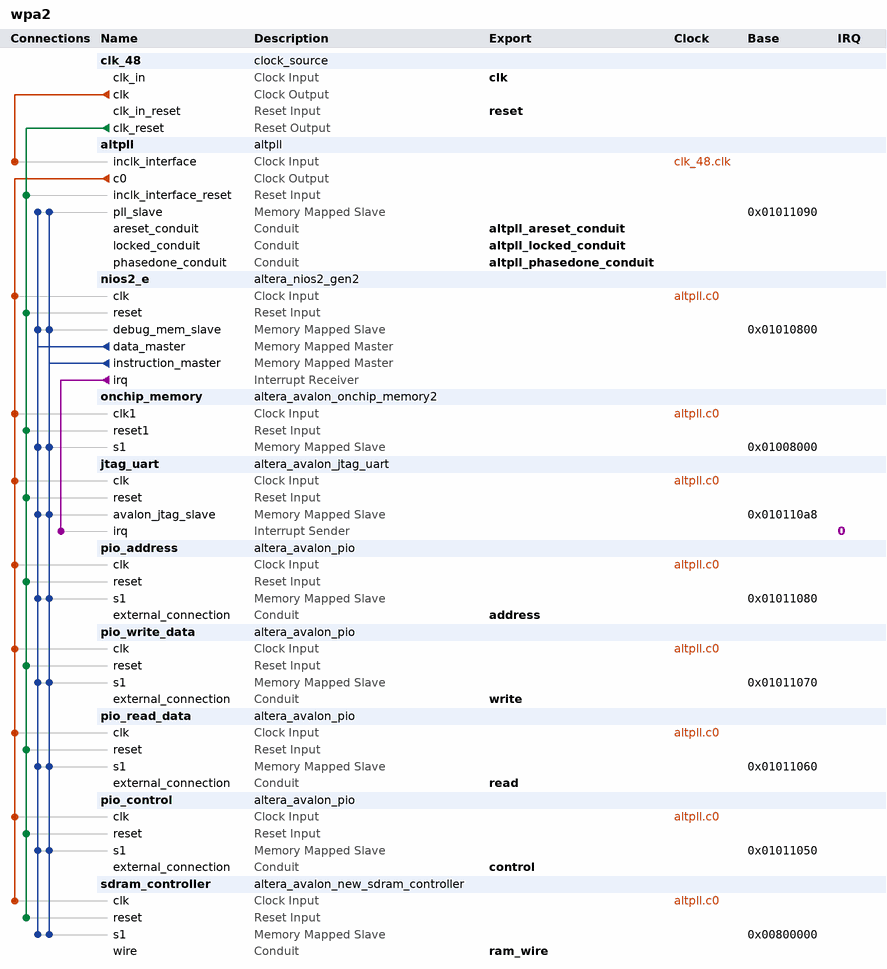
[diagram p0: system contents]
# Platform Designer (Qsys) system wpa2, Cyclone IV E EP4CE6E22C8
# Parameters at their usual value, and those the tool derives, are not listed.
package require -exact qsys 15.1
create_system wpa2
set_project_property DEVICE_FAMILY {Cyclone IV E}
set_project_property DEVICE EP4CE6E22C8

add_instance clk_48 clock_source 15.1
set_instance_parameter_value clk_48 clockFrequency 50000000

add_instance altpll altpll 15.1
set_instance_parameter_value altpll CLK0_DIVIDE_BY 12
set_instance_parameter_value altpll CLK0_MULTIPLY_BY 25
set_instance_parameter_value altpll INCLK0_INPUT_FREQUENCY 20833
set_instance_parameter_value altpll PORT_ARESET PORT_UNUSED
set_instance_parameter_value altpll PORT_LOCKED PORT_UNUSED
set_instance_parameter_value altpll PORT_clk1 PORT_UNUSED
set_instance_parameter_value altpll PORT_clk2 PORT_UNUSED
set_instance_parameter_value altpll PORT_clk3 PORT_UNUSED

add_instance nios2_e altera_nios2_gen2 15.1
set_instance_parameter_value nios2_e dcache_size 2048
set_instance_parameter_value nios2_e exceptionSlave onchip_memory.s1
set_instance_parameter_value nios2_e icache_size 4096
set_instance_parameter_value nios2_e impl Tiny
set_instance_parameter_value nios2_e resetSlave onchip_memory.s1

add_instance onchip_memory altera_avalon_onchip_memory2 15.1
set_instance_parameter_value onchip_memory dataWidth 32
set_instance_parameter_value onchip_memory dualPort false
set_instance_parameter_value onchip_memory initMemContent true
set_instance_parameter_value onchip_memory initializationFileName onchip_mem.hex
set_instance_parameter_value onchip_memory memorySize 25480

add_instance jtag_uart altera_avalon_jtag_uart 15.1
set_instance_parameter_value jtag_uart simInteractiveOptions NO_INTERACTIVE_WINDOWS

add_instance pio_address altera_avalon_pio 15.1
set_instance_parameter_value pio_address direction Output
set_instance_parameter_value pio_address width 8

add_instance pio_write_data altera_avalon_pio 15.1
set_instance_parameter_value pio_write_data direction Output
set_instance_parameter_value pio_write_data width 32

add_instance pio_read_data altera_avalon_pio 15.1
set_instance_parameter_value pio_read_data direction Input
set_instance_parameter_value pio_read_data simDoTestBenchWiring true
set_instance_parameter_value pio_read_data width 32

add_instance pio_control altera_avalon_pio 15.1
set_instance_parameter_value pio_control direction Bidir
set_instance_parameter_value pio_control simDoTestBenchWiring true
set_instance_parameter_value pio_control width 8

add_instance sdram_controller altera_avalon_new_sdram_controller 15.1
set_instance_parameter_value sdram_controller TAC 5.0
set_instance_parameter_value sdram_controller TRCD 20.0
set_instance_parameter_value sdram_controller TRP 20.0
set_instance_parameter_value sdram_controller casLatency 3
set_instance_parameter_value sdram_controller columnWidth 8
set_instance_parameter_value sdram_controller dataWidth 16
set_instance_parameter_value sdram_controller generateSimulationModel false
set_instance_parameter_value sdram_controller model single_Micron_MT48LC4M32B2_7_chip
set_instance_parameter_value sdram_controller numberOfBanks 4
set_instance_parameter_value sdram_controller numberOfChipSelects 1
set_instance_parameter_value sdram_controller powerUpDelay 100.0
set_instance_parameter_value sdram_controller refreshPeriod 15.625
set_instance_parameter_value sdram_controller rowWidth 12

# connections
add_connection altpll.c0 jtag_uart.clk clock
add_connection altpll.c0 nios2_e.clk clock
add_connection altpll.c0 onchip_memory.clk1 clock
add_connection altpll.c0 pio_address.clk clock
add_connection altpll.c0 pio_control.clk clock
add_connection altpll.c0 pio_read_data.clk clock
add_connection altpll.c0 pio_write_data.clk clock
add_connection altpll.c0 sdram_controller.clk clock
add_connection clk_48.clk altpll.inclk_interface clock
add_connection clk_48.clk_reset altpll.inclk_interface_reset reset
add_connection clk_48.clk_reset jtag_uart.reset reset
add_connection clk_48.clk_reset nios2_e.reset reset
add_connection clk_48.clk_reset onchip_memory.reset1 reset
add_connection clk_48.clk_reset pio_address.reset reset
add_connection clk_48.clk_reset pio_control.reset reset
add_connection clk_48.clk_reset pio_read_data.reset reset
add_connection clk_48.clk_reset pio_write_data.reset reset
add_connection clk_48.clk_reset sdram_controller.reset reset
add_connection nios2_e.data_master altpll.pll_slave avalon
set_connection_parameter_value nios2_e.data_master/altpll.pll_slave baseAddress 0x01011090
add_connection nios2_e.data_master jtag_uart.avalon_jtag_slave avalon
set_connection_parameter_value nios2_e.data_master/jtag_uart.avalon_jtag_slave baseAddress 0x010110a8
add_connection nios2_e.data_master nios2_e.debug_mem_slave avalon
set_connection_parameter_value nios2_e.data_master/nios2_e.debug_mem_slave baseAddress 0x01010800
add_connection nios2_e.data_master onchip_memory.s1 avalon
set_connection_parameter_value nios2_e.data_master/onchip_memory.s1 baseAddress 0x01008000
add_connection nios2_e.data_master pio_address.s1 avalon
set_connection_parameter_value nios2_e.data_master/pio_address.s1 baseAddress 0x01011080
add_connection nios2_e.data_master pio_control.s1 avalon
set_connection_parameter_value nios2_e.data_master/pio_control.s1 baseAddress 0x01011050
add_connection nios2_e.data_master pio_read_data.s1 avalon
set_connection_parameter_value nios2_e.data_master/pio_read_data.s1 baseAddress 0x01011060
add_connection nios2_e.data_master pio_write_data.s1 avalon
set_connection_parameter_value nios2_e.data_master/pio_write_data.s1 baseAddress 0x01011070
add_connection nios2_e.data_master sdram_controller.s1 avalon
set_connection_parameter_value nios2_e.data_master/sdram_controller.s1 baseAddress 0x00800000
add_connection nios2_e.instruction_master altpll.pll_slave avalon
set_connection_parameter_value nios2_e.instruction_master/altpll.pll_slave baseAddress 0x01011090
add_connection nios2_e.instruction_master jtag_uart.avalon_jtag_slave avalon
set_connection_parameter_value nios2_e.instruction_master/jtag_uart.avalon_jtag_slave baseAddress 0x010110a8
add_connection nios2_e.instruction_master nios2_e.debug_mem_slave avalon
set_connection_parameter_value nios2_e.instruction_master/nios2_e.debug_mem_slave baseAddress 0x01010800
add_connection nios2_e.instruction_master onchip_memory.s1 avalon
set_connection_parameter_value nios2_e.instruction_master/onchip_memory.s1 baseAddress 0x01008000
add_connection nios2_e.instruction_master pio_address.s1 avalon
set_connection_parameter_value nios2_e.instruction_master/pio_address.s1 baseAddress 0x01011080
add_connection nios2_e.instruction_master pio_control.s1 avalon
set_connection_parameter_value nios2_e.instruction_master/pio_control.s1 baseAddress 0x01011050
add_connection nios2_e.instruction_master pio_read_data.s1 avalon
set_connection_parameter_value nios2_e.instruction_master/pio_read_data.s1 baseAddress 0x01011060
add_connection nios2_e.instruction_master pio_write_data.s1 avalon
set_connection_parameter_value nios2_e.instruction_master/pio_write_data.s1 baseAddress 0x01011070
add_connection nios2_e.instruction_master sdram_controller.s1 avalon
set_connection_parameter_value nios2_e.instruction_master/sdram_controller.s1 baseAddress 0x00800000
add_connection nios2_e.irq jtag_uart.irq interrupt
set_connection_parameter_value nios2_e.irq/jtag_uart.irq irqNumber 0

# exported interfaces
add_interface address conduit end
set_interface_property address EXPORT_OF pio_address.external_connection
add_interface altpll_areset_conduit conduit end
set_interface_property altpll_areset_conduit EXPORT_OF altpll.areset_conduit
add_interface altpll_locked_conduit conduit end
set_interface_property altpll_locked_conduit EXPORT_OF altpll.locked_conduit
add_interface altpll_phasedone_conduit conduit end
set_interface_property altpll_phasedone_conduit EXPORT_OF altpll.phasedone_conduit
add_interface clk clock sink
set_interface_property clk EXPORT_OF clk_48.clk_in
add_interface control conduit end
set_interface_property control EXPORT_OF pio_control.external_connection
add_interface ram_wire conduit end
set_interface_property ram_wire EXPORT_OF sdram_controller.wire
add_interface read conduit end
set_interface_property read EXPORT_OF pio_read_data.external_connection
add_interface reset reset sink
set_interface_property reset EXPORT_OF clk_48.clk_in_reset
add_interface write conduit end
set_interface_property write EXPORT_OF pio_write_data.external_connection

set_interconnect_requirement {$system} qsys_mm.clockCrossingAdapter HANDSHAKE
set_interconnect_requirement {$system} qsys_mm.enableEccProtection FALSE
set_interconnect_requirement {$system} qsys_mm.insertDefaultSlave FALSE
set_interconnect_requirement {$system} qsys_mm.maxAdditionalLatency 1

save_system wpa2.qsys
